# Altium schematic sheet Sheet2.SchDoc
size A4; SheetNumber: 2; SheetTotal: 2
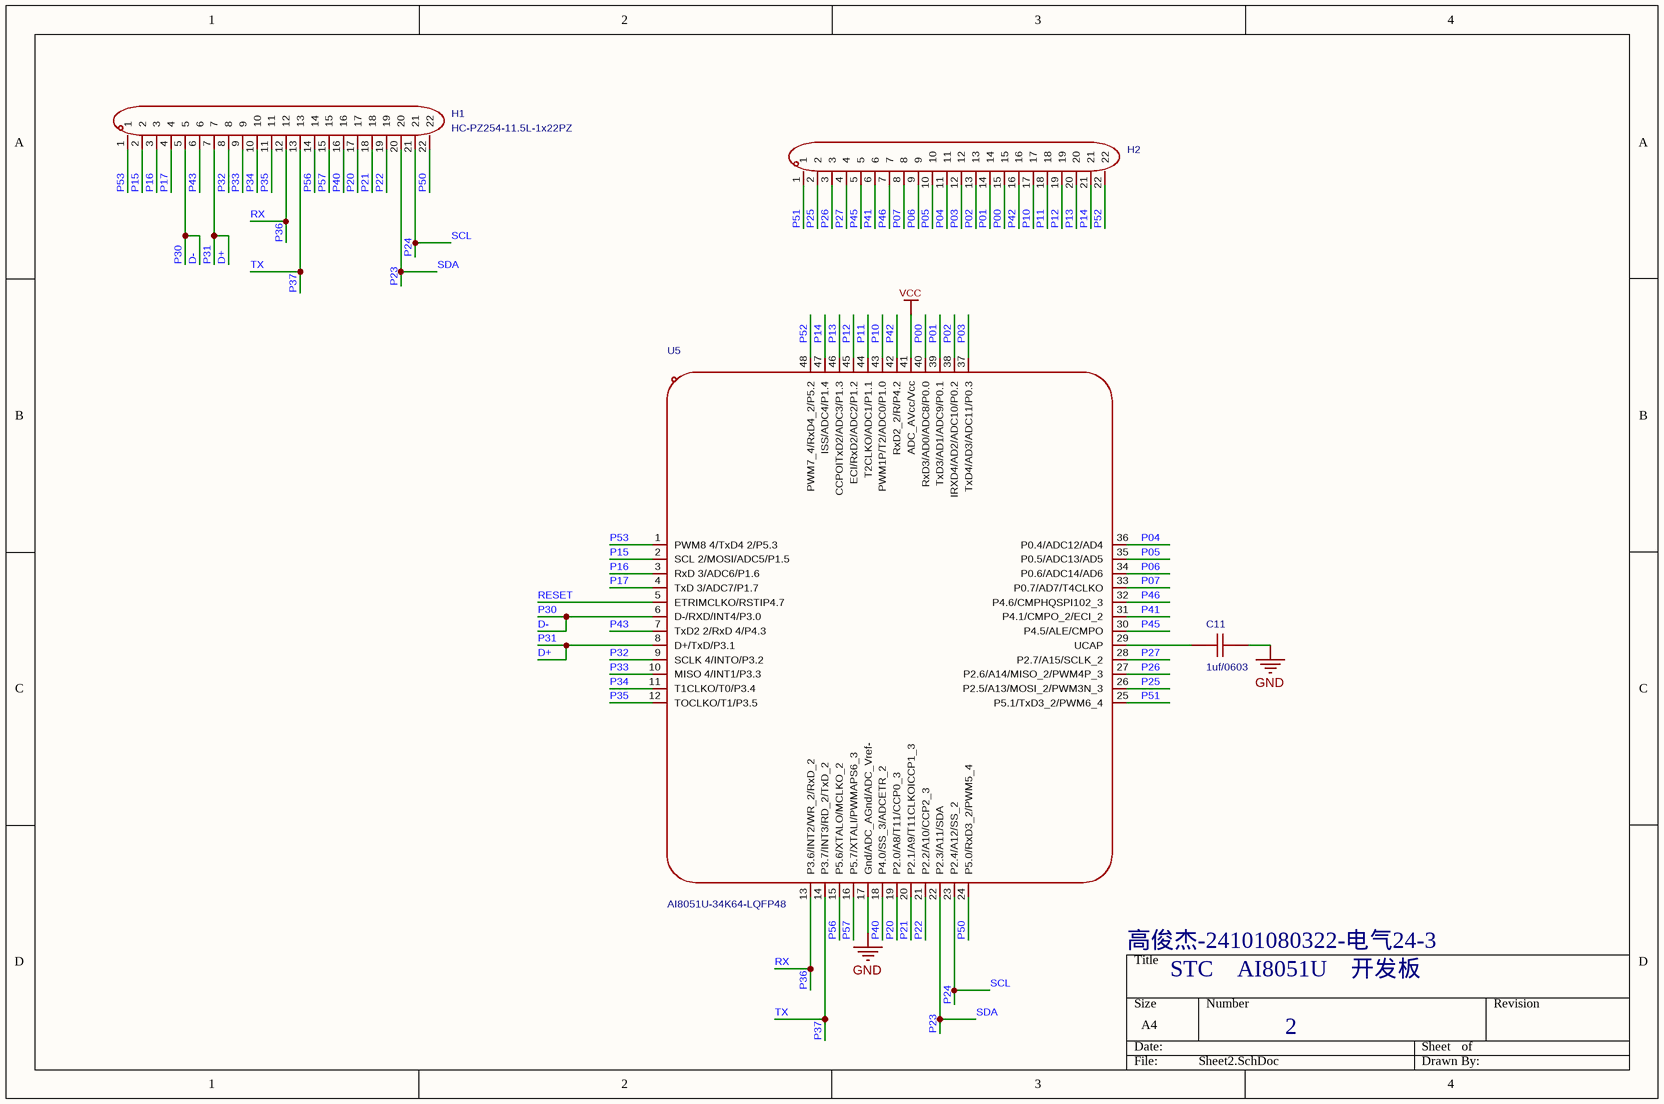
[diagram p0: Sheet2.SchDoc]

## Parts
C11  1uf/0603  [C0603]
H1  HC-PZ254-11.5L-1x22PZ  [HDR-TH_22P-P2.54-V-M]
H2  HC-PZ254-11.5L-1x22PZ  [HDR-TH_22P-P2.54-V-M]  (value not drawn)
U5  AI8051U-34K64-LQFP48  [LQFP-48_L7.0-W7.0-P0.50-LS9.0-BL]

## Nets
GND: C11.1 U5.17(Gnd/ADC_AGnd/ADC_Vref-)
VCC: U5.41(ADC_AVcc/Vcc)
D+: H1.7 U5.8(D+/TxD/P3.1)  [also labelled P31]
D-: H1.5 U5.6(D-/RXD/INT4/P3.0)  [also labelled P30]
P00: H2.15 U5.40(RxD3/AD0/ADC8/P0.0)
P01: H2.14 U5.39(TxD3/AD1/ADC9/P0.1)
P02: H2.13 U5.38(IRXD4/AD2/ADC10/P0.2)
P03: H2.12 U5.37(TxD4/AD3/ADC11/P0.3)
P04: H2.11 U5.36(P0.4/ADC12/AD4)
P05: H2.10 U5.35(P0.5/ADC13/AD5)
P06: H2.9 U5.34(P0.6/ADC14/AD6)
P07: H2.8 U5.33(P0.7/AD7/T4CLKO)
P10: H2.17 U5.43(PWM1P/T2/ADC0/P1.0)
P11: H2.18 U5.44(T2CLKO/ADC1/P1.1)
P12: H2.19 U5.45(ECI/RxD2/ADC2/P1.2)
P13: H2.20 U5.46(CCPOITxD2/ADC3/P1.3)
P14: H2.21 U5.47(ISS/ADC4/P1.4)
P15: H1.2 U5.2(SCL_2/MOSI/ADC5/P1.5)
P16: H1.3 U5.3(RxD_3/ADC6/P1.6)
P17: H1.4 U5.4(TxD_3/ADC7/P1.7)
P20: H1.17 U5.19(P2.0/A8/T11/CCP0_3)
P21: H1.18 U5.20(P2.1/A9/T11CLKOICCP1_3)
P22: H1.19 U5.21(P2.2/A10/CCP2_3)
P23: H1.20 U5.22(P2.3/A11/SDA)  [also labelled SDA]
P24: H1.21 U5.23(P2.4/A12/SS_2)  [also labelled SCL]
P25: H2.2 U5.26(P2.5/A13/MOSI_2/PWM3N_3)
P26: H2.3 U5.27(P2.6/A14/MISO_2/PWM4P_3)
P27: H2.4 U5.28(P2.7/A15/SCLK_2)
P32: H1.8 U5.9(SCLK_4/INTO/P3.2)
P33: H1.9 U5.10(MISO_4/INT1/P3.3)
P34: H1.10 U5.11(T1CLKO/T0/P3.4)
P35: H1.11 U5.12(TOCLKO/T1/P3.5)
P36: H1.12 U5.13(P3.6/INT2/WR_2/RxD_2)  [also labelled RX]
P37: H1.13 U5.14(P3.7/INT3/RD_2/TxD_2)  [also labelled TX]
P40: H1.16 U5.18(P4.0/SS_3/ADCETR_2)
P41: H2.6 U5.31(P4.1/CMPO_2/ECI_2)
P42: H2.16 U5.42(RxD2_2/R/P4.2)
P43: H1.6 U5.7(TxD2_2/RxD_4/P4.3)
P45: H2.5 U5.30(P4.5/ALE/CMPO)
P46: H2.7 U5.32(P4.6/CMPHQSPI102_3)
P50: H1.22 U5.24(P5.0/RxD3_2/PWM5_4)
P51: H2.1 U5.25(P5.1/TxD3_2/PWM6_4)
P52: H2.22 U5.48(PWM7_4/RxD4_2/P5.2)
P53: H1.1 U5.1(PWM8_4/TxD4_2/P5.3)
P56: H1.14 U5.15(P5.6/XTALO/MCLKO_2)
P57: H1.15 U5.16(P5.7/XTALI/PWMAPS6_3)
RESET: U5.5(ETRIMCLKO/RSTIP4.7)
NetC11_2: C11.2 U5.29(UCAP)

## Notes on the sheet
- (near U5) 高俊杰-24101080322-电气24-3
- STC    AI8051U    开发板
- 2

## Library data of the parts
C11 = CAP_0603: Symbol: Capacitance; 3D Model: ac125912035d415993ca9572d50418b1聨0819f05c4eef4c71ace90d822a990e87; 3D Model Transform: 62.992,31.496,0,0,0,0,0,0,0; ConvertToPcb: yes; ModelName: C0603_L1.6-W0.8-H0.8; Device: CAP_0603; Supplier Footprint: 0603; Value: 1uf/0603; AddInBom: yes; FootprintName: C0603
H1 H2 = HC-PZ254-11.5L-1x22PZ: 插针结构:1x22P;间距:2.54mm;行距:-;圆针/方针:方针;安装方式:直插;排数:单排;总PIN位数:22P;额定电流:3A;额定电压:-;配合针长度:6mm;塑高:2.5mm;端接针长度:3mm;触头材质:黄铜;触头镀层:金;工作温度:-40℃~+105℃;颜色:黑色;; Manufacturer: HC(虹成电子); AddInBom: yes; ModelId: 875f4c094945453e8148e92095c9b8a7聨0819f05c4eef4c71ace90d822a990e87; ModelName: HDR-TH_22P-P2.54-M-LI-1X22P; ModelTransform: 2199.99552,98.425,0,0,0,0,0,0,-118.11; Pin Structure: 1x22P; Pitch: 2.54mm; Circluar Pins/Square Pins: 方针; Current Rating: 3A; Symbol: HC-PZ254-11.5L-1X22PZ; Device: HC-PZ254-11.5L-1x22PZ; LCSC Part Name: 1x22P 间距:2.54mm 方针 直插; SupplierPart: C41375941; ManufacturerPart: HC-PZ254-11.5L-1x22PZ; Supplier Footprint: 插件,P=2.54mm; JLCPCB Part Class: Extended Part; Datasheet: https://item.szlcsc.com/datasheet/HC-PZ254-11.5L-1x22PZ/43143790.html; Supplier: LCSC; ConvertToPcb: yes; FootprintName: HDR-TH_22P-P2.54-V-M; Row Spacing: -; Mounting Type: 直插; Number of Rows: 单排; Number of Pins: 22P; Voltage Rating (Max): -; Length of Mating Pin: 6mm; Insulation Height: 2.5mm; Length of End Connection Pin: 3mm; Contact Material: 黄铜; Contact Plating: 金; Operating Temperature: -40℃~+105℃; Color: 黑色
U5 = AI8051U-34K64-LQFP48: 硬件浮点/硬件三角函数 跑100MHz, 32位8051-CPU 跑 44MHz，PWM 有硬件移相功能，DMA支持外设到外设，DMA支持PWM; Manufacturer: STC; AddInBom: yes; ModelId: 093be70396ff421eb2cdb946d5311efc聨0819f05c4eef4c71ace90d822a990e87; ModelName: LQFP-48_L7.0-W7.0-H1.4-LS9.0-P0.50; ModelTransform: 354.331,354.331,0,0,0,0,0,0,0; Symbol: AI8051U-34K64-LQFP48; Device: AI8051U-34K64-LQFP48; LCSC Part Name: 单片机(MCU/MPU/SOC); SupplierPart: C42388168; ManufacturerPart: AI8051U-34K64-LQFP48; Supplier Footprint: LQFP-48(7x7); JLCPCB Part Class: Extended Part; Datasheet: https://item.szlcsc.com/datasheet/AI8051U-34K64-LQFP48/44315053.html; Supplier: LCSC; ConvertToPcb: yes; FootprintName: LQFP-48_L7.0-W7.0-P0.50-LS9.0-BL